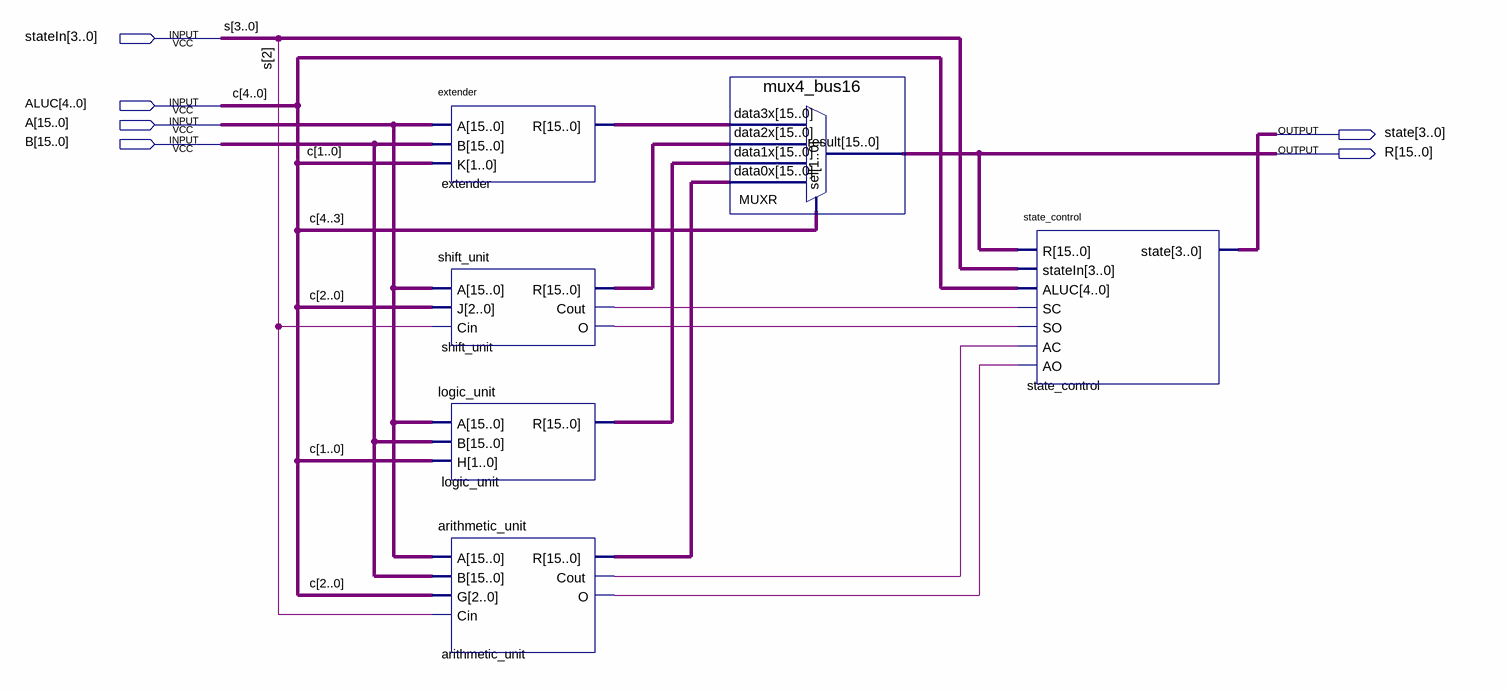
[diagram p0: schematic sheet]
// Quartus schematic ALU.bdf as structural Verilog: 6 symbols, 6 pins
module ALU (
  input  [3:0] stateIn,
  input  [4:0] ALUC,
  input  [15:0] A,
  input  [15:0] B,
  output [3:0] state,
  output [15:0] R
);

  wire arithmetic_unit_cout, arithmetic_unit_o, shift_unit_cout, shift_unit_o;
  wire [15:0] arithmetic_unit_r, extender_r, logic_unit_r, shift_unit_r;

  extender extender (.A(A), .B(B), .K(ALUC[1:0]), .R(extender_r));
  shift_unit shift_unit (
    .A(A), .J(ALUC[2:0]), .Cin(stateIn[2]), .R(shift_unit_r), .Cout(shift_unit_cout), .O(shift_unit_o));
  logic_unit logic_unit (.A(A), .B(B), .H(ALUC[1:0]), .R(logic_unit_r));
  arithmetic_unit arithmetic_unit (
    .A(A), .B(B), .G(ALUC[2:0]), .Cin(stateIn[2]), .R(arithmetic_unit_r), .Cout(arithmetic_unit_cout),
    .O(arithmetic_unit_o));
  mux4_bus16 MUXR (
    .data3x(extender_r), .data2x(shift_unit_r), .data1x(logic_unit_r), .data0x(arithmetic_unit_r),
    .sel(ALUC[4:3]), .result(R));
  state_control state_control (
    .R(R), .stateIn(stateIn), .ALUC(ALUC), .SC(shift_unit_cout), .SO(shift_unit_o),
    .AC(arithmetic_unit_cout), .AO(arithmetic_unit_o), .state(state));

  // Other names for the same wires on the sheet: c[4:0] = ALUC; s[3:0] = stateIn
endmodule
